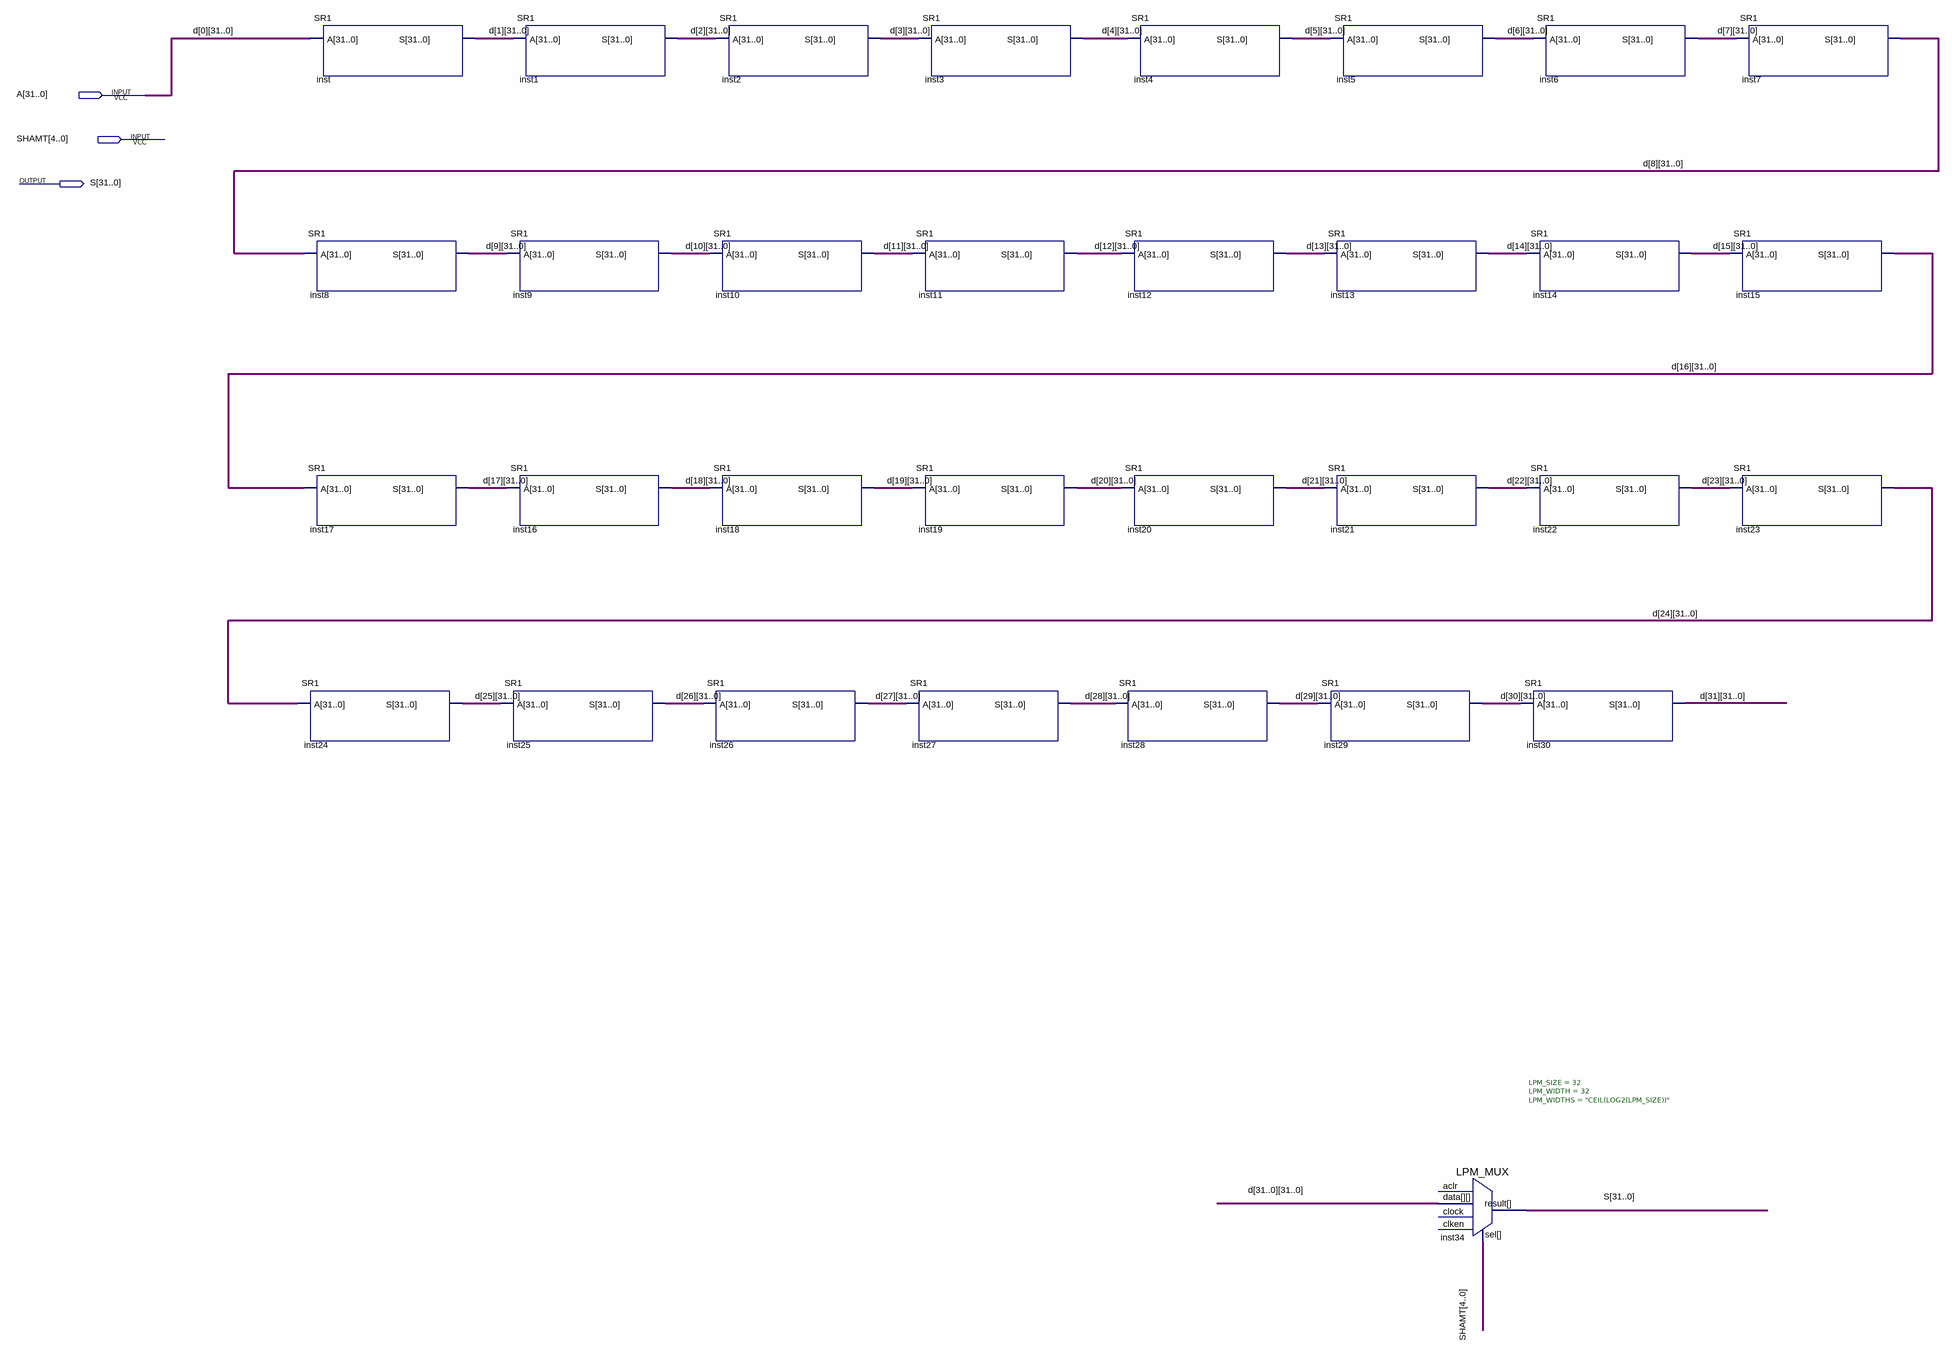
[diagram p0: schematic sheet]
// Quartus schematic SR.bdf as structural Verilog: 32 symbols, 3 pins
module SR (
  input  [31:0] A,
  input  [4:0] SHAMT,
  output [31:0] S
);

  wire [31:0] d_1, d_2, d_3, d_4, d_5, d_6, d_7, d_8, d_9, d_10, d_11, d_12, d_13, d_14, d_15, d_16, d_17,
       d_18, d_19, d_20, d_21, d_22, d_23, d_24, d_25, d_26, d_27, d_28, d_29, d_30, d_31;

  SR1 inst (.A(A), .S(d_1));
  SR1 inst8 (.A(d_8), .S(d_9));
  SR1 inst17 (.A(d_16), .S(d_17));
  SR1 inst24 (.A(d_24), .S(d_25));
  SR1 inst1 (.A(d_1), .S(d_2));
  SR1 inst9 (.A(d_9), .S(d_10));
  SR1 inst16 (.A(d_17), .S(d_18));
  SR1 inst25 (.A(d_25), .S(d_26));
  SR1 inst2 (.A(d_2), .S(d_3));
  SR1 inst10 (.A(d_10), .S(d_11));
  SR1 inst18 (.A(d_18), .S(d_19));
  SR1 inst26 (.A(d_26), .S(d_27));
  SR1 inst3 (.A(d_3), .S(d_4));
  SR1 inst11 (.A(d_11), .S(d_12));
  SR1 inst19 (.A(d_19), .S(d_20));
  SR1 inst27 (.A(d_27), .S(d_28));
  SR1 inst4 (.A(d_4), .S(d_5));
  SR1 inst12 (.A(d_12), .S(d_13));
  SR1 inst20 (.A(d_20), .S(d_21));
  SR1 inst28 (.A(d_28), .S(d_29));
  SR1 inst5 (.A(d_5), .S(d_6));
  SR1 inst13 (.A(d_13), .S(d_14));
  SR1 inst21 (.A(d_21), .S(d_22));
  SR1 inst29 (.A(d_29), .S(d_30));
  LPM_MUX #(.LPM_SIZE(32), .LPM_WIDTH(32), .LPM_WIDTHS("CEIL(LOG2(LPM_SIZE))")) inst34 (
    .data({d_31, d_30, d_29, d_28, d_27, d_26, d_25, d_24, d_23, d_22, d_21, d_20, d_19, d_18, d_17, d_16, d_15, d_14, d_13, d_12, d_11, d_10, d_9, d_8, d_7, d_6, d_5, d_4, d_3, d_2, d_1, A}),
    .sel(SHAMT), .result(S));  // open: clock, aclr, clken
  SR1 inst6 (.A(d_6), .S(d_7));
  SR1 inst14 (.A(d_14), .S(d_15));
  SR1 inst22 (.A(d_22), .S(d_23));
  SR1 inst30 (.A(d_30), .S(d_31));
  SR1 inst7 (.A(d_7), .S(d_8));
  SR1 inst15 (.A(d_15), .S(d_16));
  SR1 inst23 (.A(d_23), .S(d_24));

  // Other names for the same wires on the sheet: d_0[31:0] = A
endmodule
